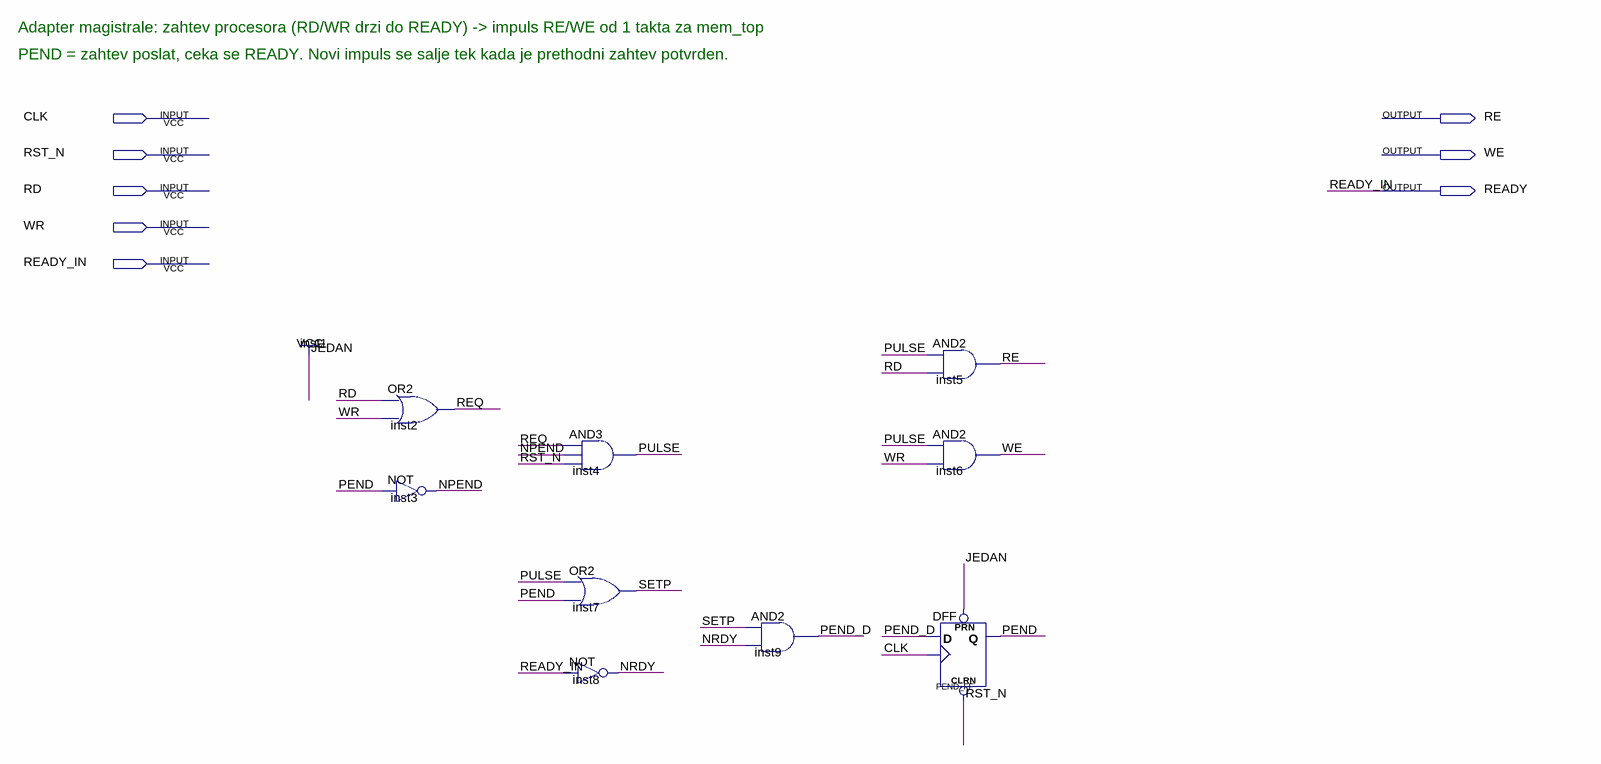
[diagram p0: schematic sheet]
// Quartus schematic bus_adapter.bdf as structural Verilog: 9 symbols, 8 pins
module bus_adapter (
  input  CLK,
  input  RST_N,
  input  RD,
  input  WR,
  input  READY_IN,
  output RE,
  output WE,
  output READY
);

  wire NPEND, NRDY, PEND, PEND_D, PULSE, REQ, SETP;

  or inst2 (REQ, RD, WR);
  not inst3 (NPEND, PEND);
  and inst4 (PULSE, REQ, NPEND, RST_N);
  or inst7 (SETP, PULSE, PEND);
  not inst8 (NRDY, READY_IN);
  and inst9 (PEND_D, SETP, NRDY);
  and inst5 (RE, PULSE, RD);
  and inst6 (WE, PULSE, WR);
  DFF PEND_FF (.CLRN(RST_N), .CLK(CLK), .D(PEND_D), .PRN(1'b1), .Q(PEND));

  assign READY = READY_IN;

  // Notes on the sheet:
  //   Adapter magistrale: zahtev procesora (RD/WR drzi do READY) -> impuls RE/WE od 1 takta za mem_top
  //   PEND = zahtev poslat, ceka se READY. Novi impuls se salje tek kada je prethodni zahtev potvrden.
endmodule
